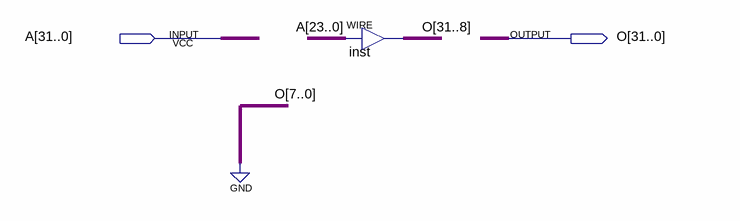
[diagram p0: schematic sheet]
// Quartus schematic shifter.bdf as structural Verilog: 1 symbols, 2 pins
module shifter (
  input  [31:0] A,
  output [31:0] O
);

  assign O[31:8] = A[23:0];  // WIRE inst

  assign O[7:0] = {8{1'b0}};
endmodule
